# EAGLE design lipo (EAGLE 7.2.0)
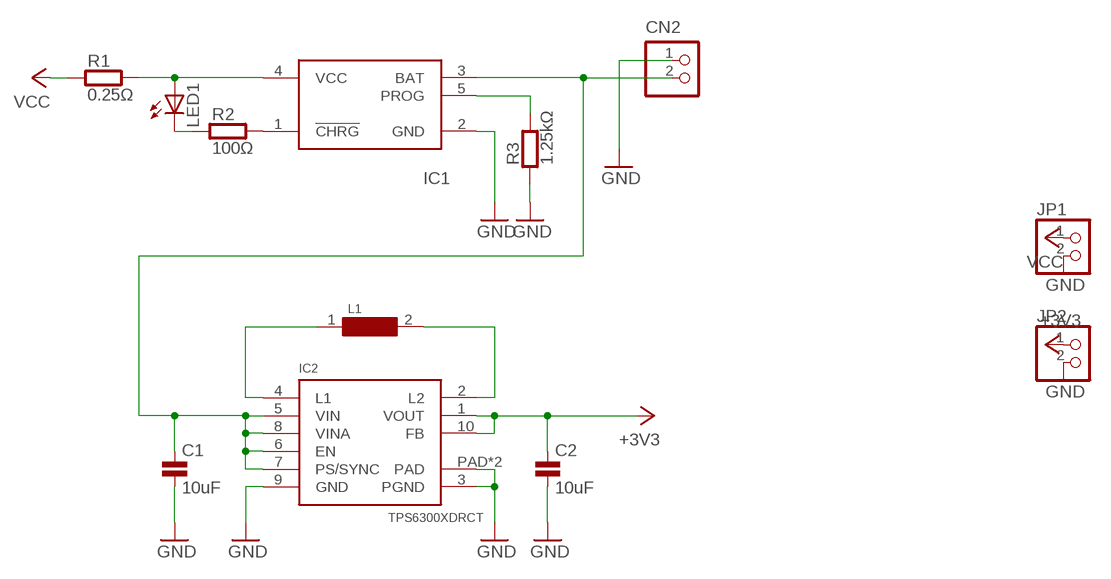
[diagram p0: schematic, sheet 1]

## Parts
C1  10uF  C0603  [0603]
C2  10uF  C0603  [0603]
CN2  S2B-PH-K-S  [S2B-PH-K-S]
IC1  LTC4054  [TSOT23-5]
IC2  TPS6300XDRCT  [S-PVSON-N10]
JP1  PINHD-1X2  [1X02]
JP2  PINHD-1X2  [1X02]
L1  VLF4012ST  [VLF4012ST]
LED1  LEDSML0603  [SML0603]
R1  0.25Ω  R0603  [0603]
R2  100Ω  R0603  [0603]
R3  1.25kΩ  R0603  [0603]

## Nets
+3V3: C2.1 IC2.1(VOUT) IC2.10(FB) JP2.1
GND: C1.2 C2.2 CN2.1 IC1.2(GND) IC2.3(PGND) IC2.9(GND) IC2.PAD IC2.PAD@1(PAD) JP1.2 JP2.2 R3.1
N$3: IC1.5(PROG) R3.2
N$4: IC1.4(VCC) LED1.A R1.2
N$6: IC1.1(!CHRG!) R2.2
N$7: LED1.C R2.1
N$8: IC2.4(L1) L1.1
N$9: IC2.2(L2) L1.2
N$13: C1.1 CN2.2 IC1.3(BAT) IC2.5(VIN) IC2.6(EN) IC2.7(PS/SYNC) IC2.8(VINA)
VCC: JP1.1 R1.1

## Library data of the parts
C1 C2 = untitled:C: CAPACITOR
CN2 = jst-ph:S2B-PH-*: Wire-to-Board 2.0mm pitch side mount connector Source: http://www.jst-mfg.com/product/pdf/jpn/PH.pdf http://www.jst-mfg.com/product/detail.php?series=199
IC1 = untitled:LTC4054
IC2 = untitled:TPS6300XDRCT
JP1 JP2 = pinhead:PINHD-1X2: PIN HEADER
L1 = untitled:VLF4012ST
LED1 = led:LED: LED OSRAM: - CHIPLED LG R971, LG N971, LY N971, LG Q971, LY Q971, LO R971, LY R971 LH N974, LH R974 LS Q976, LO Q976, LY Q976 LO Q996 - Hyper CHIPLED LW Q18S LB Q993, LB Q99A, LB R99A - SideLED LS A670, LO A670, LY A670, LG A670, LP A670 LB A673, LV A673, LT A673, LW A673 LH A674 LY A675 LS A676, LA A676, LO A676, LY A676, LW A676 LS A679, LY A679, LG A679 - Hyper Micro SIDELED® LS Y876, LA Y876, LO Y876, LY Y876 LT Y87S - SmartLED LW L88C, LW L88S LB L89C, LB L89S, LG L890 LS L89K, LO L89K, LY L89K LS L896, LA L896, LO L896, LY L896 - TOPLED LS T670, LO T670, LY T670, LG T670, LP T670 LSG T670, LSP T670, LSY T670, LOP T670, LYG T670 LG T671, LOG T671, LSG T671 LB T673, LV T673, LT T673, LW T673 LH T674 LS T676, LA T676, LO T676, LY T676, LB T676, LH T676, LSB T676, LW T676 LB T67C, LV T67C, LT T67C, LS T67K, LO T67K, LY T67K, LW E67C LS E67B, LA E67B, LO E67B, LY E67B, LB E67C, LV E67C, LT E67C LW T67C LS T679, LY T679, LG T679 LS T770, LO T770, LY T770, LG T770, LP T770 LB T773, LV T773, LT T773, LW T773 LH T774 LS E675, LA E675, LY E675, LS T675 LS T776, LA T776, LO T776, LY T776, LB T776 LHGB T686 LT T68C, LB T68C - Hyper Mini TOPLED® LB M676 - Mini TOPLED Santana® LG M470 LS M47K, LO M47K, LY M47K Source: http://www.osram.convergy.de LUXEON: - LUMILED® LXK2-PW12-R00, LXK2-PW12-S00, LXK2-PW14-U00, LXK2-PW14-V00 LXK2-PM12-R00, LXK2-PM12-S00, LXK2-PM14-U00 LXK2-PE12-Q00, LXK2-PE12-R00, LXK2-PE12-S00, LXK2-PE14-T00, LXK2-PE14-U00 LXK2-PB12-K00, LXK2-PB12-L00, LXK2-PB12-M00, LXK2-PB14-N00, LXK2-PB14-P00, LXK2-PB14-Q00 LXK2-PR12-L00, LXK2-PR12-M00, LXK2-PR14-Q00, LXK2-PR14-R00 LXK2-PD12-Q00, LXK2-PD12-R00, LXK2-PD12-S00 LXK2-PH12-R00, LXK2-PH12-S00 LXK2-PL12-P00, LXK2-PL12-Q00, LXK2-PL12-R00 Source: www.luxeon.com KINGBRIGHT: KA-3528ASYC Source: www.kingbright.com
R1-R3 = untitled:R: RESISTOR

## Board
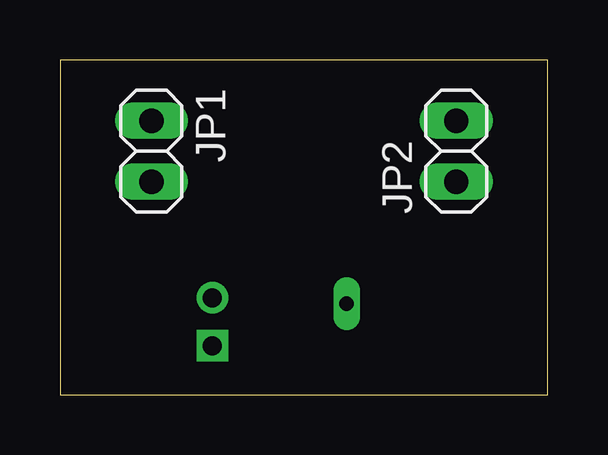
[diagram p1: board, top side]
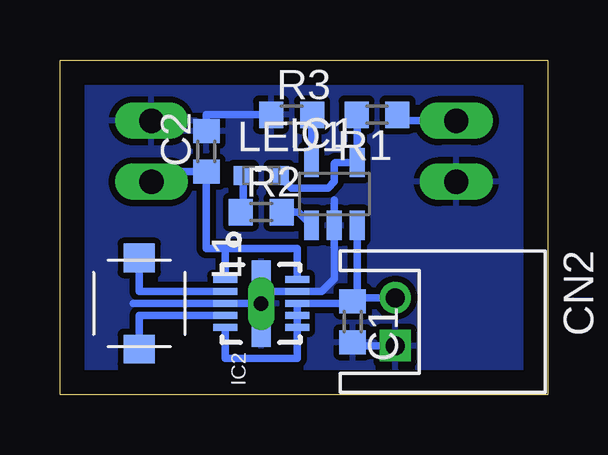
[diagram p2: board, bottom side, seen from below]

Size 20.32 x 13.97 mm. Coordinates in mm from the lower left corner, seen from the top.
Outline: 0,0 20.32,0 20.32,13.97 0,13.97 0,0
Copper layers (1*16): Top 0.035mm / dielectric 1.5mm / Bottom 0.035mm
Design rules "default *": minimum track width 10mil, minimum drill 24mil, track to track 0.2mm, track to pad 0.2mm, pad to pad 0.2mm, via to via 0.2mm, smd to smd 0.2mm, copper to edge 40mil, drill to drill 8mil, minimum pad ring 10mil, minimum via ring 8mil, stop-mask expansion 4mil, vias tented up to drill 0mil, thermal gap 10mil

### Footprints (pad centres in the part's own frame; a part is rotated, then mirrored left to right if it is on the bottom)
0603 = smd 1 x 1.1: 1 -0.85,0; 2 0.85,0
S2B-PH-K-S = drill 0.8 square: 1 1,0 | drill 0.8: 2 -1,0
TSOT23-5 = smd 0.62 x 1.22: 1 -0.95,-1.31; 2 0,-1.31; 3 0.95,-1.31; 4 0.95,1.31; 5 -0.95,1.31
S-PVSON-N10 = smd 0.3 x 1: 1 -1,-1.5; 2 -0.5,-1.5; 3 0,-1.5; 4 0.5,-1.5; 5 1,-1.5; 6 1,1.5; 7 0.5,1.5; 8 0,1.5; 9 -0.5,1.5; 10 -1,1.5 | smd 3.6 x 0.8: PAD 0,0 | drill 0.6 long: PAD@1 0,0
1X02 = drill 1.016 long: 1 -1.27,0; 2 1.27,0
VLF4012ST = smd 1.2 x 1.3: 1 1.9,0; 2 -1.9,0
SML0603 = smd 0.8 x 0.8: A 0.75,0; C -0.75,0

### Placement (x,y rotation side)
C1  8.13,3.05 270 bottom
C2  14.22,10.16 90 bottom
CN2  6.35,3.05 270 bottom
IC1  8.89,8.38 0 bottom
IC2  11.94,3.81 270 bottom
JP1  3.81,10.16 270 top
JP2  16.51,10.16 90 top
L1  17.02,3.81 270 bottom
LED1  11.94,9.14 0 bottom
R1  7.11,11.68 180 bottom
R2  11.94,7.62 0 bottom
R3  10.67,11.68 0 bottom

### Tracks (layer width: path | path; a pad name or v marks a point on that pad's centre or on a via)
+3V3
  Bottom 0.305: IC2.1 13.44,6.1 | 13.44,6.1 10.44,6.1 IC2.10 | JP2.1 16.51,9.31 C2.1 14.22,6.1 13.44,6.1
GND
  Bottom 0.305: R3.1 14.22,11.68 C2.2 | 8.89,8.13 IC1.2 8.89,4.83 9.41,4.31 IC2.9 11.68,4.31 11.94,4.57 IC2.PAD@1 IC2.3 17.27,3.81 | CN2.1 7.98,2.05 arc90 C1.2
  pour Bottom (isolate 0.254): 0,13.97 20.32,13.97 20.32,0 0,0
N$3
  Bottom 0.305: R3.2 9.84,11.68 IC1.5
N$4
  Bottom 0.305: R1.2 7.94,11.68 IC1.4 8.85,9.69 8.89,9.65 8.89,8.89 9.14,8.64 10.68,8.64 LED1.A
N$6
  Bottom 0.305: IC1.1 10.39,7.62 R2.2
N$7
  Bottom 0.305: R2.1 12.69,7.72 LED1.C
N$8
  Bottom 0.305: IC2.4 17.02,3.31 L1.1
N$9
  Bottom 0.305: IC2.2 17.02,4.31 L1.2
N$13
  Bottom 0.305: IC2.5 13.44,1.52 10.44,1.52 IC2.6 IC2.7 IC2.8 8.22,3.81 C1.1 | CN2.2 7.98,4.05 arc-90 C1.1 | IC1.3 7.94,4.09 arc90 C1.1
VCC
  Bottom 0.305: 6.35,11.68 R1.1 6.26,11.43 JP1.1